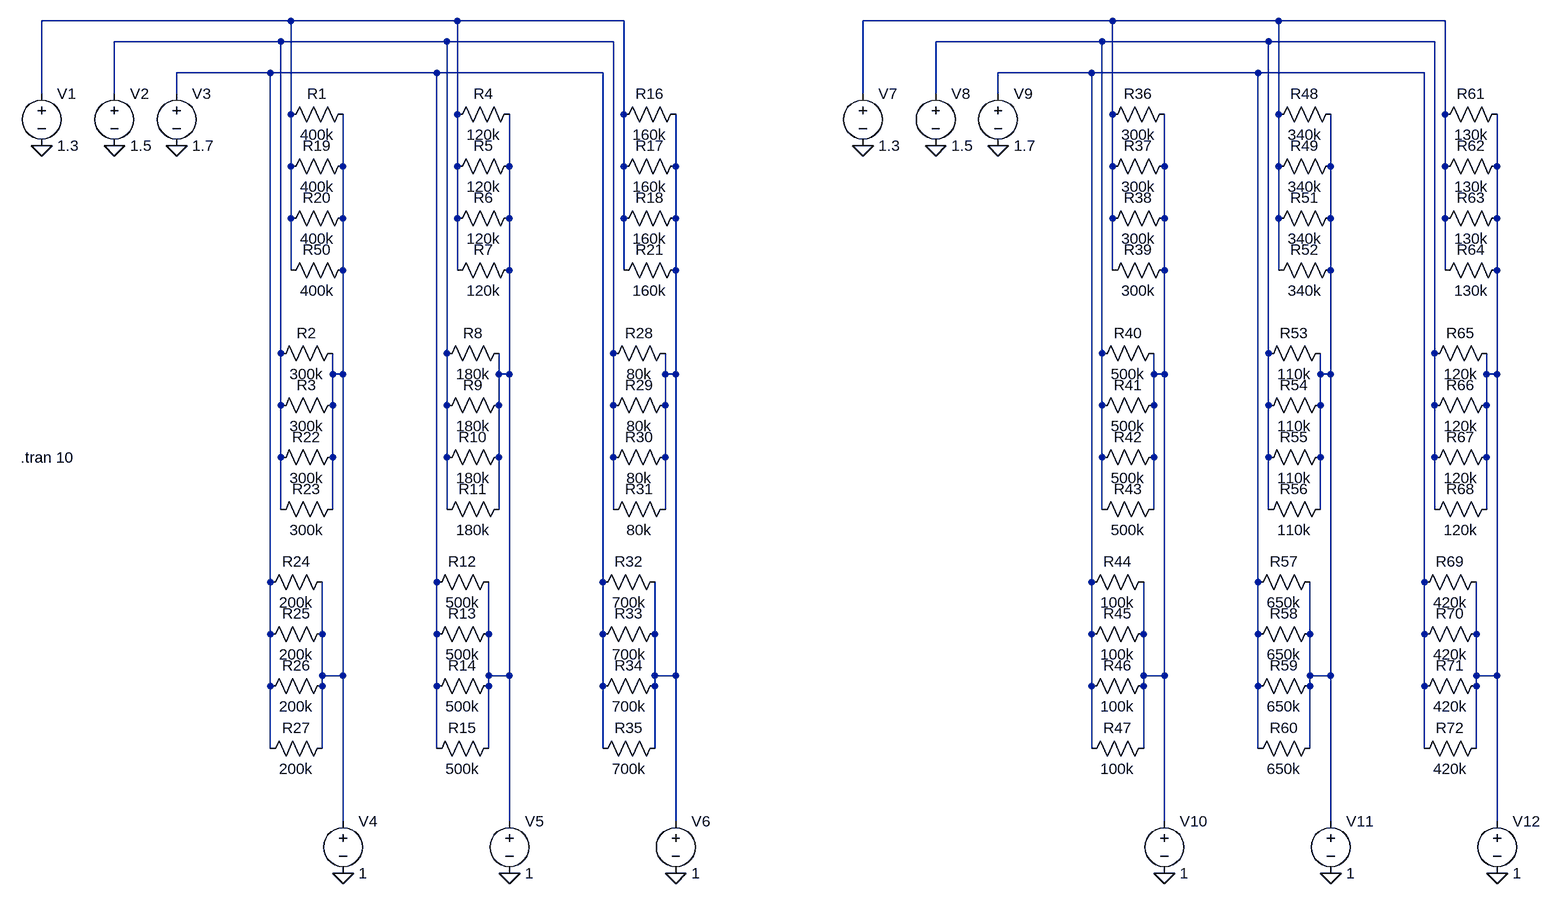
[diagram p0: schematic MAC module final.asc]
MAC module final.asc, the LTspice schematic file:
Version 4.1
SHEET 1 1944 996
WIRE -256 -336 -640 -336
WIRE 0 -336 -256 -336
WIRE 256 -336 0 -336
WIRE 1008 -336 624 -336
WIRE 1264 -336 1008 -336
WIRE 1520 -336 1264 -336
WIRE -272 -304 -528 -304
WIRE -16 -304 -272 -304
WIRE 240 -304 -16 -304
WIRE 992 -304 736 -304
WIRE 1248 -304 992 -304
WIRE 1504 -304 1248 -304
WIRE -288 -256 -432 -256
WIRE -32 -256 -288 -256
WIRE 224 -256 -32 -256
WIRE 976 -256 832 -256
WIRE 1232 -256 976 -256
WIRE 1488 -256 1232 -256
WIRE -640 -224 -640 -336
WIRE -528 -224 -528 -304
WIRE -432 -224 -432 -256
WIRE 624 -224 624 -336
WIRE 736 -224 736 -304
WIRE 832 -224 832 -256
WIRE -256 -192 -256 -336
WIRE 0 -192 0 -336
WIRE 256 -192 256 -336
WIRE 1008 -192 1008 -336
WIRE 1264 -192 1264 -336
WIRE 1520 -192 1520 -336
WIRE -256 -112 -256 -192
WIRE -176 -112 -176 -192
WIRE 0 -112 0 -192
WIRE 80 -112 80 -192
WIRE 256 -112 256 -192
WIRE 336 -112 336 -192
WIRE 1008 -112 1008 -192
WIRE 1088 -112 1088 -192
WIRE 1264 -112 1264 -192
WIRE 1344 -112 1344 -192
WIRE 1520 -112 1520 -192
WIRE 1600 -112 1600 -192
WIRE -256 -32 -256 -112
WIRE -176 -32 -176 -112
WIRE 0 -32 0 -112
WIRE 80 -32 80 -112
WIRE 256 -32 256 -112
WIRE 336 -32 336 -112
WIRE 1008 -32 1008 -112
WIRE 1088 -32 1088 -112
WIRE 1264 -32 1264 -112
WIRE 1344 -32 1344 -112
WIRE 1520 -32 1520 -112
WIRE 1600 -32 1600 -112
WIRE -256 48 -256 -32
WIRE -176 48 -176 -32
WIRE 0 48 0 -32
WIRE 80 48 80 -32
WIRE 256 48 256 -32
WIRE 336 48 336 -32
WIRE 1008 48 1008 -32
WIRE 1088 48 1088 -32
WIRE 1264 48 1264 -32
WIRE 1344 48 1344 -32
WIRE 1520 48 1520 -32
WIRE 1600 48 1600 -32
WIRE -272 176 -272 -304
WIRE -16 176 -16 -304
WIRE 240 176 240 -304
WIRE 992 176 992 -304
WIRE 1248 176 1248 -304
WIRE 1504 176 1504 -304
WIRE -192 208 -192 176
WIRE -176 208 -176 48
WIRE -176 208 -192 208
WIRE 64 208 64 176
WIRE 80 208 80 48
WIRE 80 208 64 208
WIRE 320 208 320 176
WIRE 336 208 336 48
WIRE 336 208 320 208
WIRE 1072 208 1072 176
WIRE 1088 208 1088 48
WIRE 1088 208 1072 208
WIRE 1328 208 1328 176
WIRE 1344 208 1344 48
WIRE 1344 208 1328 208
WIRE 1584 208 1584 176
WIRE 1600 208 1600 48
WIRE 1600 208 1584 208
WIRE -272 256 -272 176
WIRE -192 256 -192 208
WIRE -16 256 -16 176
WIRE 64 256 64 208
WIRE 240 256 240 176
WIRE 320 256 320 208
WIRE 992 256 992 176
WIRE 1072 256 1072 208
WIRE 1248 256 1248 176
WIRE 1328 256 1328 208
WIRE 1504 256 1504 176
WIRE 1584 256 1584 208
WIRE -272 336 -272 256
WIRE -192 336 -192 256
WIRE -16 336 -16 256
WIRE 64 336 64 256
WIRE 240 336 240 256
WIRE 320 336 320 256
WIRE 992 336 992 256
WIRE 1072 336 1072 256
WIRE 1248 336 1248 256
WIRE 1328 336 1328 256
WIRE 1504 336 1504 256
WIRE 1584 336 1584 256
WIRE -272 416 -272 336
WIRE -192 416 -192 336
WIRE -16 416 -16 336
WIRE 64 416 64 336
WIRE 240 416 240 336
WIRE 320 416 320 336
WIRE 992 416 992 336
WIRE 1072 416 1072 336
WIRE 1248 416 1248 336
WIRE 1328 416 1328 336
WIRE 1504 416 1504 336
WIRE 1584 416 1584 336
WIRE -288 528 -288 -256
WIRE -32 528 -32 -256
WIRE 224 528 224 -256
WIRE 976 528 976 -256
WIRE 1232 528 1232 -256
WIRE 1488 528 1488 -256
WIRE -288 608 -288 528
WIRE -208 608 -208 528
WIRE -32 608 -32 528
WIRE 48 608 48 528
WIRE 224 608 224 528
WIRE 304 608 304 528
WIRE 976 608 976 528
WIRE 1056 608 1056 528
WIRE 1232 608 1232 528
WIRE 1312 608 1312 528
WIRE 1488 608 1488 528
WIRE 1568 608 1568 528
WIRE -208 672 -208 608
WIRE -176 672 -176 208
WIRE -176 672 -208 672
WIRE 48 672 48 608
WIRE 80 672 80 208
WIRE 80 672 48 672
WIRE 304 672 304 608
WIRE 336 672 336 208
WIRE 336 672 304 672
WIRE 1056 672 1056 608
WIRE 1088 672 1088 208
WIRE 1088 672 1056 672
WIRE 1312 672 1312 608
WIRE 1344 672 1344 208
WIRE 1344 672 1312 672
WIRE 1568 672 1568 608
WIRE 1600 672 1600 208
WIRE 1600 672 1568 672
WIRE -288 688 -288 608
WIRE -208 688 -208 672
WIRE -32 688 -32 608
WIRE 48 688 48 672
WIRE 224 688 224 608
WIRE 304 688 304 672
WIRE 976 688 976 608
WIRE 1056 688 1056 672
WIRE 1232 688 1232 608
WIRE 1312 688 1312 672
WIRE 1488 688 1488 608
WIRE 1568 688 1568 672
WIRE -288 784 -288 688
WIRE -208 784 -208 688
WIRE -32 784 -32 688
WIRE 48 784 48 688
WIRE 224 784 224 688
WIRE 304 784 304 688
WIRE 976 784 976 688
WIRE 1056 784 1056 688
WIRE 1232 784 1232 688
WIRE 1312 784 1312 688
WIRE 1488 784 1488 688
WIRE 1568 784 1568 688
WIRE -176 896 -176 672
WIRE 80 896 80 672
WIRE 336 896 336 672
WIRE 1088 896 1088 672
WIRE 1344 896 1344 672
WIRE 1600 896 1600 672
FLAG -640 -144 0
FLAG -528 -144 0
FLAG -432 -144 0
FLAG -176 976 0
FLAG 80 976 0
FLAG 336 976 0
FLAG 624 -144 0
FLAG 736 -144 0
FLAG 832 -144 0
FLAG 1088 976 0
FLAG 1344 976 0
FLAG 1600 976 0
SYMBOL voltage -640 -240 R0
WINDOW 123 0 0 Left 0
WINDOW 39 0 0 Left 0
SYMATTR InstName V1
SYMATTR Value 1.3
SYMBOL voltage -528 -240 R0
WINDOW 123 0 0 Left 0
WINDOW 39 0 0 Left 0
SYMATTR InstName V2
SYMATTR Value 1.5
SYMBOL voltage -432 -240 R0
WINDOW 123 0 0 Left 0
WINDOW 39 0 0 Left 0
SYMATTR InstName V3
SYMATTR Value 1.7
SYMBOL res -160 -208 R90
WINDOW 0 0 56 VBottom 2
WINDOW 3 32 56 VTop 2
SYMATTR InstName R1
SYMATTR Value 400k
SYMBOL res -160 -128 R90
WINDOW 0 0 56 VBottom 2
WINDOW 3 32 56 VTop 2
SYMATTR InstName R19
SYMATTR Value 400k
SYMBOL res -160 -48 R90
WINDOW 0 0 56 VBottom 2
WINDOW 3 32 56 VTop 2
SYMATTR InstName R20
SYMATTR Value 400k
SYMBOL res -160 32 R90
WINDOW 0 0 56 VBottom 2
WINDOW 3 32 56 VTop 2
SYMATTR InstName R50
SYMATTR Value 400k
SYMBOL res -176 160 R90
WINDOW 0 0 56 VBottom 2
WINDOW 3 32 56 VTop 2
SYMATTR InstName R2
SYMATTR Value 300k
SYMBOL res -176 240 R90
WINDOW 0 0 56 VBottom 2
WINDOW 3 32 56 VTop 2
SYMATTR InstName R3
SYMATTR Value 300k
SYMBOL res -176 320 R90
WINDOW 0 0 56 VBottom 2
WINDOW 3 32 56 VTop 2
SYMATTR InstName R22
SYMATTR Value 300k
SYMBOL res -176 400 R90
WINDOW 0 0 56 VBottom 2
WINDOW 3 32 56 VTop 2
SYMATTR InstName R23
SYMATTR Value 300k
SYMBOL res -192 512 R90
WINDOW 0 0 56 VBottom 2
WINDOW 3 32 56 VTop 2
SYMATTR InstName R24
SYMATTR Value 200k
SYMBOL res -192 592 R90
WINDOW 0 0 56 VBottom 2
WINDOW 3 32 56 VTop 2
SYMATTR InstName R25
SYMATTR Value 200k
SYMBOL res -192 672 R90
WINDOW 0 0 56 VBottom 2
WINDOW 3 32 56 VTop 2
SYMATTR InstName R26
SYMATTR Value 200k
SYMBOL res -192 768 R90
WINDOW 0 0 56 VBottom 2
WINDOW 3 32 56 VTop 2
SYMATTR InstName R27
SYMATTR Value 200k
SYMBOL voltage -176 880 R0
SYMATTR InstName V4
SYMATTR Value 1
SYMBOL res 96 -208 R90
WINDOW 0 0 56 VBottom 2
WINDOW 3 32 56 VTop 2
SYMATTR InstName R4
SYMATTR Value 120k
SYMBOL res 96 -128 R90
WINDOW 0 0 56 VBottom 2
WINDOW 3 32 56 VTop 2
SYMATTR InstName R5
SYMATTR Value 120k
SYMBOL res 96 -48 R90
WINDOW 0 0 56 VBottom 2
WINDOW 3 32 56 VTop 2
SYMATTR InstName R6
SYMATTR Value 120k
SYMBOL res 96 32 R90
WINDOW 0 0 56 VBottom 2
WINDOW 3 32 56 VTop 2
SYMATTR InstName R7
SYMATTR Value 120k
SYMBOL res 80 160 R90
WINDOW 0 0 56 VBottom 2
WINDOW 3 32 56 VTop 2
SYMATTR InstName R8
SYMATTR Value 180k
SYMBOL res 80 240 R90
WINDOW 0 0 56 VBottom 2
WINDOW 3 32 56 VTop 2
SYMATTR InstName R9
SYMATTR Value 180k
SYMBOL res 80 320 R90
WINDOW 0 0 56 VBottom 2
WINDOW 3 32 56 VTop 2
SYMATTR InstName R10
SYMATTR Value 180k
SYMBOL res 80 400 R90
WINDOW 0 0 56 VBottom 2
WINDOW 3 32 56 VTop 2
SYMATTR InstName R11
SYMATTR Value 180k
SYMBOL res 64 512 R90
WINDOW 0 0 56 VBottom 2
WINDOW 3 32 56 VTop 2
SYMATTR InstName R12
SYMATTR Value 500k
SYMBOL res 64 592 R90
WINDOW 0 0 56 VBottom 2
WINDOW 3 32 56 VTop 2
SYMATTR InstName R13
SYMATTR Value 500k
SYMBOL res 64 672 R90
WINDOW 0 0 56 VBottom 2
WINDOW 3 32 56 VTop 2
SYMATTR InstName R14
SYMATTR Value 500k
SYMBOL res 64 768 R90
WINDOW 0 0 56 VBottom 2
WINDOW 3 32 56 VTop 2
SYMATTR InstName R15
SYMATTR Value 500k
SYMBOL voltage 80 880 R0
SYMATTR InstName V5
SYMATTR Value 1
SYMBOL res 352 -208 R90
WINDOW 0 0 56 VBottom 2
WINDOW 3 32 56 VTop 2
SYMATTR InstName R16
SYMATTR Value 160k
SYMBOL res 352 -128 R90
WINDOW 0 0 56 VBottom 2
WINDOW 3 32 56 VTop 2
SYMATTR InstName R17
SYMATTR Value 160k
SYMBOL res 352 -48 R90
WINDOW 0 0 56 VBottom 2
WINDOW 3 32 56 VTop 2
SYMATTR InstName R18
SYMATTR Value 160k
SYMBOL res 352 32 R90
WINDOW 0 0 56 VBottom 2
WINDOW 3 32 56 VTop 2
SYMATTR InstName R21
SYMATTR Value 160k
SYMBOL res 336 160 R90
WINDOW 0 0 56 VBottom 2
WINDOW 3 32 56 VTop 2
SYMATTR InstName R28
SYMATTR Value 80k
SYMBOL res 336 240 R90
WINDOW 0 0 56 VBottom 2
WINDOW 3 32 56 VTop 2
SYMATTR InstName R29
SYMATTR Value 80k
SYMBOL res 336 320 R90
WINDOW 0 0 56 VBottom 2
WINDOW 3 32 56 VTop 2
SYMATTR InstName R30
SYMATTR Value 80k
SYMBOL res 336 400 R90
WINDOW 0 0 56 VBottom 2
WINDOW 3 32 56 VTop 2
SYMATTR InstName R31
SYMATTR Value 80k
SYMBOL res 320 512 R90
WINDOW 0 0 56 VBottom 2
WINDOW 3 32 56 VTop 2
SYMATTR InstName R32
SYMATTR Value 700k
SYMBOL res 320 592 R90
WINDOW 0 0 56 VBottom 2
WINDOW 3 32 56 VTop 2
SYMATTR InstName R33
SYMATTR Value 700k
SYMBOL res 320 672 R90
WINDOW 0 0 56 VBottom 2
WINDOW 3 32 56 VTop 2
SYMATTR InstName R34
SYMATTR Value 700k
SYMBOL res 320 768 R90
WINDOW 0 0 56 VBottom 2
WINDOW 3 32 56 VTop 2
SYMATTR InstName R35
SYMATTR Value 700k
SYMBOL voltage 336 880 R0
SYMATTR InstName V6
SYMATTR Value 1
SYMBOL voltage 624 -240 R0
WINDOW 123 0 0 Left 0
WINDOW 39 0 0 Left 0
SYMATTR InstName V7
SYMATTR Value 1.3
SYMBOL voltage 736 -240 R0
WINDOW 123 0 0 Left 0
WINDOW 39 0 0 Left 0
SYMATTR InstName V8
SYMATTR Value 1.5
SYMBOL voltage 832 -240 R0
WINDOW 123 0 0 Left 0
WINDOW 39 0 0 Left 0
SYMATTR InstName V9
SYMATTR Value 1.7
SYMBOL res 1104 -208 R90
WINDOW 0 0 56 VBottom 2
WINDOW 3 32 56 VTop 2
SYMATTR InstName R36
SYMATTR Value 300k
SYMBOL res 1104 -128 R90
WINDOW 0 0 56 VBottom 2
WINDOW 3 32 56 VTop 2
SYMATTR InstName R37
SYMATTR Value 300k
SYMBOL res 1104 -48 R90
WINDOW 0 0 56 VBottom 2
WINDOW 3 32 56 VTop 2
SYMATTR InstName R38
SYMATTR Value 300k
SYMBOL res 1104 32 R90
WINDOW 0 0 56 VBottom 2
WINDOW 3 32 56 VTop 2
SYMATTR InstName R39
SYMATTR Value 300k
SYMBOL res 1088 160 R90
WINDOW 0 0 56 VBottom 2
WINDOW 3 32 56 VTop 2
SYMATTR InstName R40
SYMATTR Value 500k
SYMBOL res 1088 240 R90
WINDOW 0 0 56 VBottom 2
WINDOW 3 32 56 VTop 2
SYMATTR InstName R41
SYMATTR Value 500k
SYMBOL res 1088 320 R90
WINDOW 0 0 56 VBottom 2
WINDOW 3 32 56 VTop 2
SYMATTR InstName R42
SYMATTR Value 500k
SYMBOL res 1088 400 R90
WINDOW 0 0 56 VBottom 2
WINDOW 3 32 56 VTop 2
SYMATTR InstName R43
SYMATTR Value 500k
SYMBOL res 1072 512 R90
WINDOW 0 0 56 VBottom 2
WINDOW 3 32 56 VTop 2
SYMATTR InstName R44
SYMATTR Value 100k
SYMBOL res 1072 592 R90
WINDOW 0 0 56 VBottom 2
WINDOW 3 32 56 VTop 2
SYMATTR InstName R45
SYMATTR Value 100k
SYMBOL res 1072 672 R90
WINDOW 0 0 56 VBottom 2
WINDOW 3 32 56 VTop 2
SYMATTR InstName R46
SYMATTR Value 100k
SYMBOL res 1072 768 R90
WINDOW 0 0 56 VBottom 2
WINDOW 3 32 56 VTop 2
SYMATTR InstName R47
SYMATTR Value 100k
SYMBOL voltage 1088 880 R0
SYMATTR InstName V10
SYMATTR Value 1
SYMBOL res 1360 -208 R90
WINDOW 0 0 56 VBottom 2
WINDOW 3 32 56 VTop 2
SYMATTR InstName R48
SYMATTR Value 340k
SYMBOL res 1360 -128 R90
WINDOW 0 0 56 VBottom 2
WINDOW 3 32 56 VTop 2
SYMATTR InstName R49
SYMATTR Value 340k
SYMBOL res 1360 -48 R90
WINDOW 0 0 56 VBottom 2
WINDOW 3 32 56 VTop 2
SYMATTR InstName R51
SYMATTR Value 340k
SYMBOL res 1360 32 R90
WINDOW 0 0 56 VBottom 2
WINDOW 3 32 56 VTop 2
SYMATTR InstName R52
SYMATTR Value 340k
SYMBOL res 1344 160 R90
WINDOW 0 0 56 VBottom 2
WINDOW 3 32 56 VTop 2
SYMATTR InstName R53
SYMATTR Value 110k
SYMBOL res 1344 240 R90
WINDOW 0 0 56 VBottom 2
WINDOW 3 32 56 VTop 2
SYMATTR InstName R54
SYMATTR Value 110k
SYMBOL res 1344 320 R90
WINDOW 0 0 56 VBottom 2
WINDOW 3 32 56 VTop 2
SYMATTR InstName R55
SYMATTR Value 110k
SYMBOL res 1344 400 R90
WINDOW 0 0 56 VBottom 2
WINDOW 3 32 56 VTop 2
SYMATTR InstName R56
SYMATTR Value 110k
SYMBOL res 1328 512 R90
WINDOW 0 0 56 VBottom 2
WINDOW 3 32 56 VTop 2
SYMATTR InstName R57
SYMATTR Value 650k
SYMBOL res 1328 592 R90
WINDOW 0 0 56 VBottom 2
WINDOW 3 32 56 VTop 2
SYMATTR InstName R58
SYMATTR Value 650k
SYMBOL res 1328 672 R90
WINDOW 0 0 56 VBottom 2
WINDOW 3 32 56 VTop 2
SYMATTR InstName R59
SYMATTR Value 650k
SYMBOL res 1328 768 R90
WINDOW 0 0 56 VBottom 2
WINDOW 3 32 56 VTop 2
SYMATTR InstName R60
SYMATTR Value 650k
SYMBOL voltage 1344 880 R0
SYMATTR InstName V11
SYMATTR Value 1
SYMBOL res 1616 -208 R90
WINDOW 0 0 56 VBottom 2
WINDOW 3 32 56 VTop 2
SYMATTR InstName R61
SYMATTR Value 130k
SYMBOL res 1616 -128 R90
WINDOW 0 0 56 VBottom 2
WINDOW 3 32 56 VTop 2
SYMATTR InstName R62
SYMATTR Value 130k
SYMBOL res 1616 -48 R90
WINDOW 0 0 56 VBottom 2
WINDOW 3 32 56 VTop 2
SYMATTR InstName R63
SYMATTR Value 130k
SYMBOL res 1616 32 R90
WINDOW 0 0 56 VBottom 2
WINDOW 3 32 56 VTop 2
SYMATTR InstName R64
SYMATTR Value 130k
SYMBOL res 1600 160 R90
WINDOW 0 0 56 VBottom 2
WINDOW 3 32 56 VTop 2
SYMATTR InstName R65
SYMATTR Value 120k
SYMBOL res 1600 240 R90
WINDOW 0 0 56 VBottom 2
WINDOW 3 32 56 VTop 2
SYMATTR InstName R66
SYMATTR Value 120k
SYMBOL res 1600 320 R90
WINDOW 0 0 56 VBottom 2
WINDOW 3 32 56 VTop 2
SYMATTR InstName R67
SYMATTR Value 120k
SYMBOL res 1600 400 R90
WINDOW 0 0 56 VBottom 2
WINDOW 3 32 56 VTop 2
SYMATTR InstName R68
SYMATTR Value 120k
SYMBOL res 1584 512 R90
WINDOW 0 0 56 VBottom 2
WINDOW 3 32 56 VTop 2
SYMATTR InstName R69
SYMATTR Value 420k
SYMBOL res 1584 592 R90
WINDOW 0 0 56 VBottom 2
WINDOW 3 32 56 VTop 2
SYMATTR InstName R70
SYMATTR Value 420k
SYMBOL res 1584 672 R90
WINDOW 0 0 56 VBottom 2
WINDOW 3 32 56 VTop 2
SYMATTR InstName R71
SYMATTR Value 420k
SYMBOL res 1584 768 R90
WINDOW 0 0 56 VBottom 2
WINDOW 3 32 56 VTop 2
SYMATTR InstName R72
SYMATTR Value 420k
SYMBOL voltage 1600 880 R0
SYMATTR InstName V12
SYMATTR Value 1
TEXT -672 336 Left 2 !.tran 10

The netlist it stands for:
* MAC module final.asc
V1 N001 0 1.3
V2 N003 0 1.5
V3 N005 0 1.7
R1 N007 N001 400k
R19 N007 N001 400k
R20 N007 N001 400k
R50 N007 N001 400k
R2 N007 N003 300k
R3 N007 N003 300k
R22 N007 N003 300k
R23 N007 N003 300k
R24 N007 N005 200k
R25 N007 N005 200k
R26 N007 N005 200k
R27 N007 N005 200k
V4 N007 0 1
R4 N008 N001 120k
R5 N008 N001 120k
R6 N008 N001 120k
R7 N008 N001 120k
R8 N008 N003 180k
R9 N008 N003 180k
R10 N008 N003 180k
R11 N008 N003 180k
R12 N008 N005 500k
R13 N008 N005 500k
R14 N008 N005 500k
R15 N008 N005 500k
V5 N008 0 1
R16 N009 N001 160k
R17 N009 N001 160k
R18 N009 N001 160k
R21 N009 N001 160k
R28 N009 N003 80k
R29 N009 N003 80k
R30 N009 N003 80k
R31 N009 N003 80k
R32 N009 N005 700k
R33 N009 N005 700k
R34 N009 N005 700k
R35 N009 N005 700k
V6 N009 0 1
V7 N002 0 1.3
V8 N004 0 1.5
V9 N006 0 1.7
R36 N010 N002 300k
R37 N010 N002 300k
R38 N010 N002 300k
R39 N010 N002 300k
R40 N010 N004 500k
R41 N010 N004 500k
R42 N010 N004 500k
R43 N010 N004 500k
R44 N010 N006 100k
R45 N010 N006 100k
R46 N010 N006 100k
R47 N010 N006 100k
V10 N010 0 1
R48 N011 N002 340k
R49 N011 N002 340k
R51 N011 N002 340k
R52 N011 N002 340k
R53 N011 N004 110k
R54 N011 N004 110k
R55 N011 N004 110k
R56 N011 N004 110k
R57 N011 N006 650k
R58 N011 N006 650k
R59 N011 N006 650k
R60 N011 N006 650k
V11 N011 0 1
R61 N012 N002 130k
R62 N012 N002 130k
R63 N012 N002 130k
R64 N012 N002 130k
R65 N012 N004 120k
R66 N012 N004 120k
R67 N012 N004 120k
R68 N012 N004 120k
R69 N012 N006 420k
R70 N012 N006 420k
R71 N012 N006 420k
R72 N012 N006 420k
V12 N012 0 1
.tran 10
.backanno
.end